# EAGLE design tes1 (EAGLE 6.2)
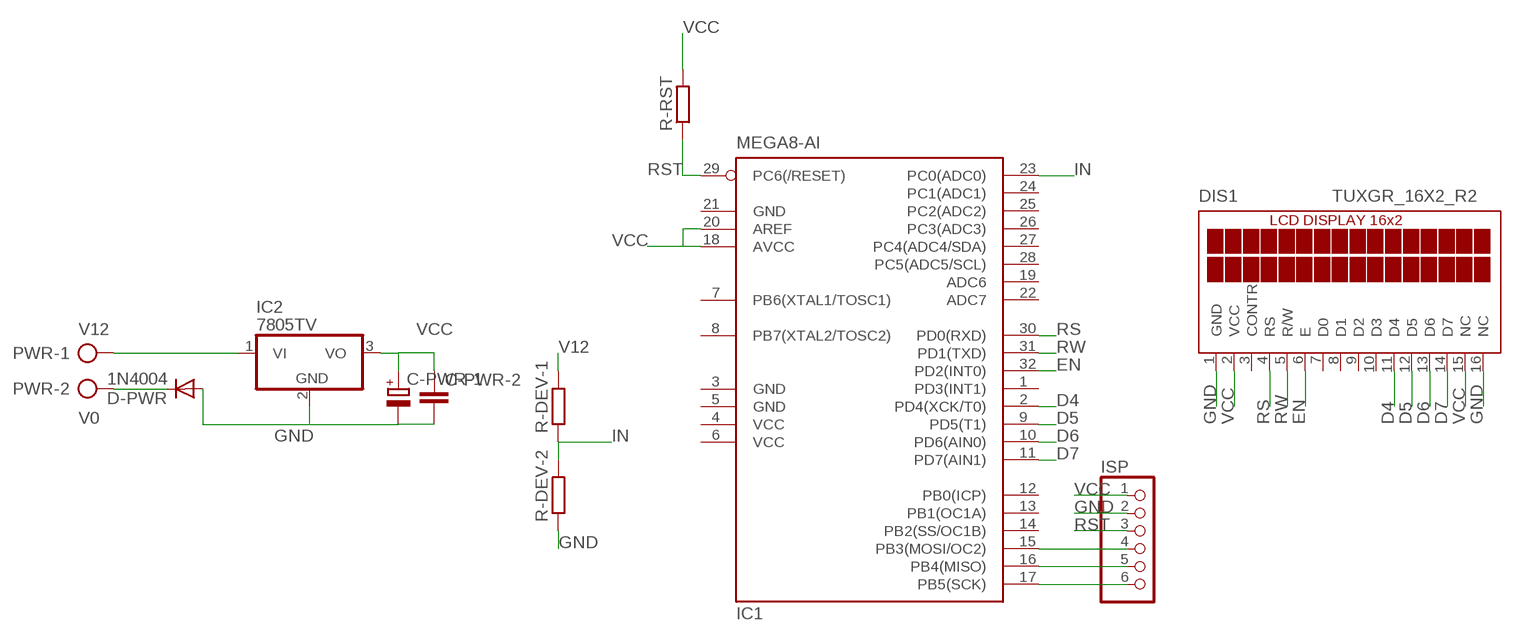
[diagram p0: schematic, sheet 1]

## Parts
C-PWR-1  CPOL-EUE2-5  [E2-5]
C-PWR-2  C-EU050-024X044  [C050-024X044]
D-PWR  1N4004  [DO41-10]
DIS1  TUXGR_16X2_R2  [TUXGR_16X2_R2]
IC1  MEGA8-AI  [TQFP32-08]
IC2  7805TV  [TO220V]
ISP  PINHD-1X6  [1X06]
PWR  AK300/2  [AK300/2]
R-DEV-1  R-EU_0204/7  [0204/7]
R-DEV-2  R-EU_0204/7  [0204/7]
R-RST  R-EU_0204/7  [0204/7]

## Nets
D4: DIS1.11(D4) IC1.2(PD4(XCK/T0))
D5: DIS1.12(D5) IC1.9(PD5(T1))
D6: DIS1.13(D6) IC1.10(PD6(AIN0))
D7: DIS1.14(D7) IC1.11(PD7(AIN1))
EN: DIS1.6(E) IC1.32(PD2(INT0))
GND: C-PWR-1.- C-PWR-2.2 D-PWR.A DIS1.1(GND) DIS1.16(NC) IC2.2(GND) ISP.2 R-DEV-2.1
IN: IC1.23(PC0(ADC0)) R-DEV-1.1 R-DEV-2.2
N$15: IC1.17(PB5(SCK)) ISP.6
N$16: IC1.16(PB4(MISO)) ISP.5
N$17: IC1.15(PB3(MOSI/OC2)) ISP.4
RS: DIS1.4(RS) IC1.30(PD0(RXD))
RST: IC1.29(PC6(/RESET)) ISP.3 R-RST.1
RW: DIS1.5(R/W) IC1.31(PD1(TXD))
V0: D-PWR.C PWR.2
V12: IC2.1(VI) PWR.1 R-DEV-1.2
VCC: C-PWR-1.+ C-PWR-2.1 DIS1.2(VCC) DIS1.15(NC) IC1.18(AVCC) IC1.20(AREF) IC2.3(VO) ISP.1 R-RST.2
Unconnected: DIS1.3(CONTR) DIS1.7(D0) DIS1.8(D1) DIS1.9(D2) DIS1.10(D3) IC1.1(PD3(INT1)) IC1.7(PB6(XTAL1/TOSC1)) IC1.8(PB7(XTAL2/TOSC2)) IC1.12(PB0(ICP)) IC1.13(PB1(OC1A)) IC1.14(PB2(SS/OC1B)) IC1.19(ADC6) IC1.22(ADC7) IC1.24(PC1(ADC1)) IC1.25(PC2(ADC2)) IC1.26(PC3(ADC3)) IC1.27(PC4(ADC4/SDA)) IC1.28(PC5(ADC5/SCL))

## Power pins joined to a net without a drawn wire
GND: IC1.3(GND) IC1.5(GND) IC1.21(GND)
VCC: IC1.4(VCC) IC1.6(VCC)

## Library data of the parts
C-PWR-1 = resistor:CPOL-EU: POLARIZED CAPACITOR, European symbol
C-PWR-2 = resistor:C-EU: CAPACITOR, European symbol
D-PWR = diode:1N4004: DIODE general purpose rectifier, 1 A
DIS1 = display-lcd:TUXGR_16X2_R2: Tuxgraphics LCD display 16x2 characters reflective, without background light Source: tuxgr_12x2_r2.pdf; OC_FARNELL: unknown; OC_NEWARK: unknown
IC1 = atmel:MEGA8: MICROCONTROLLER 8 Kbytes FLASH, 1 kbytes SRAM, 512 bytes EEPROM, USART, 6-channel 10 bit ADC, 2-channel 8 bit ADC Pin compatible with Atmega48, ATMega88, ATMega168 Source: avr.lbr; MPN: ATMEGA8-16AU; OC_FARNELL: 9171371; OC_NEWARK: 73M8863
IC2 = linear:78*: Positive VOLTAGE REGULATOR Source: http://cache.national.com/ds/LM/LM78L05.pdf http://www.fairchildsemi.com/ds/LM/LM7805.pdf
ISP = pinhead:PINHD-1X6: PIN HEADER
PWR = con-ptr500:AK300/2: CONNECTOR; OC_FARNELL: unknown; OC_NEWARK: unknown
R-DEV-1 R-DEV-2 R-RST = resistor:R-EU_: RESISTOR, European symbol

## Board
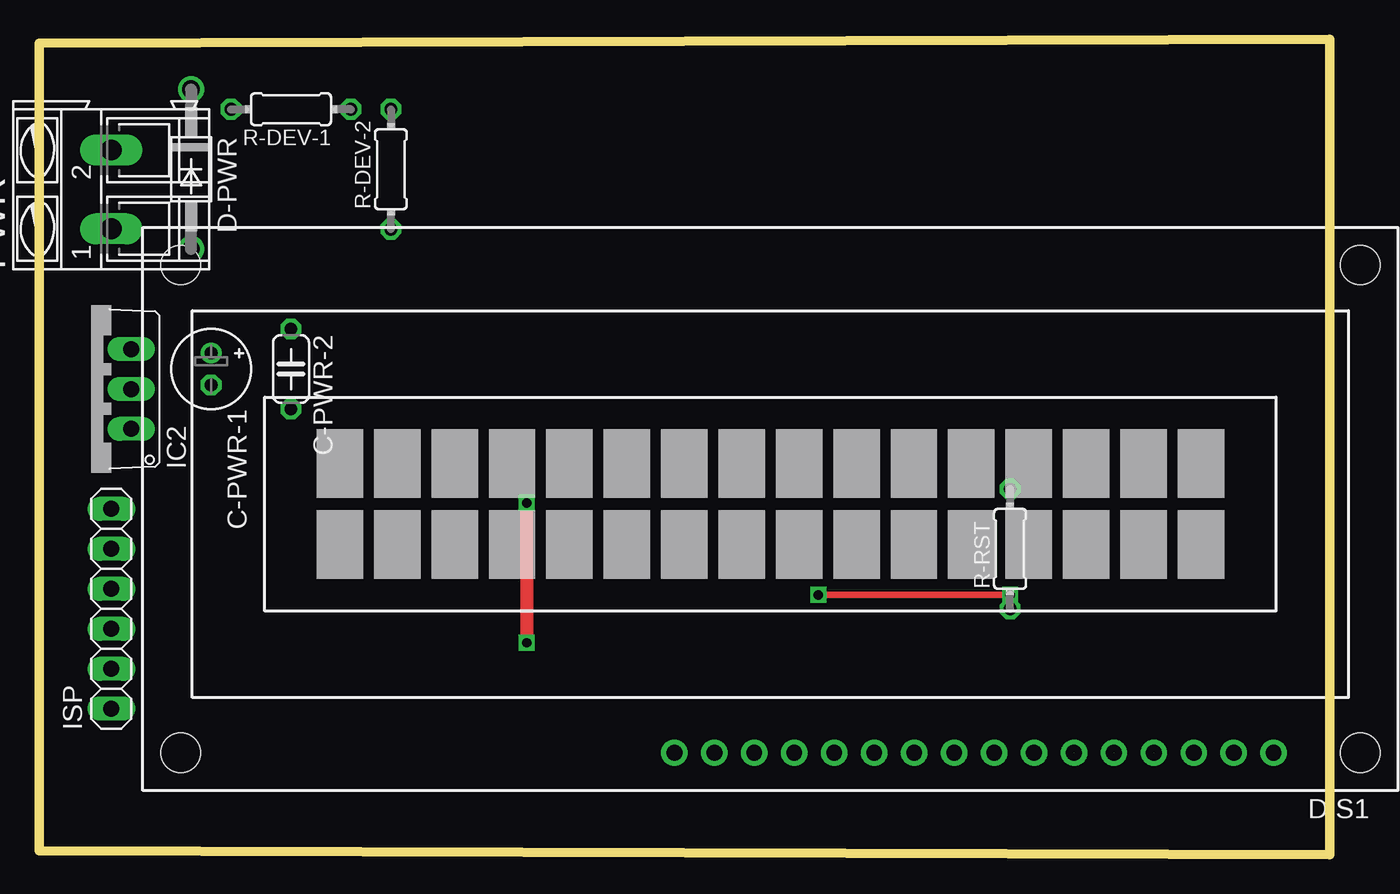
[diagram p1: board, top side]
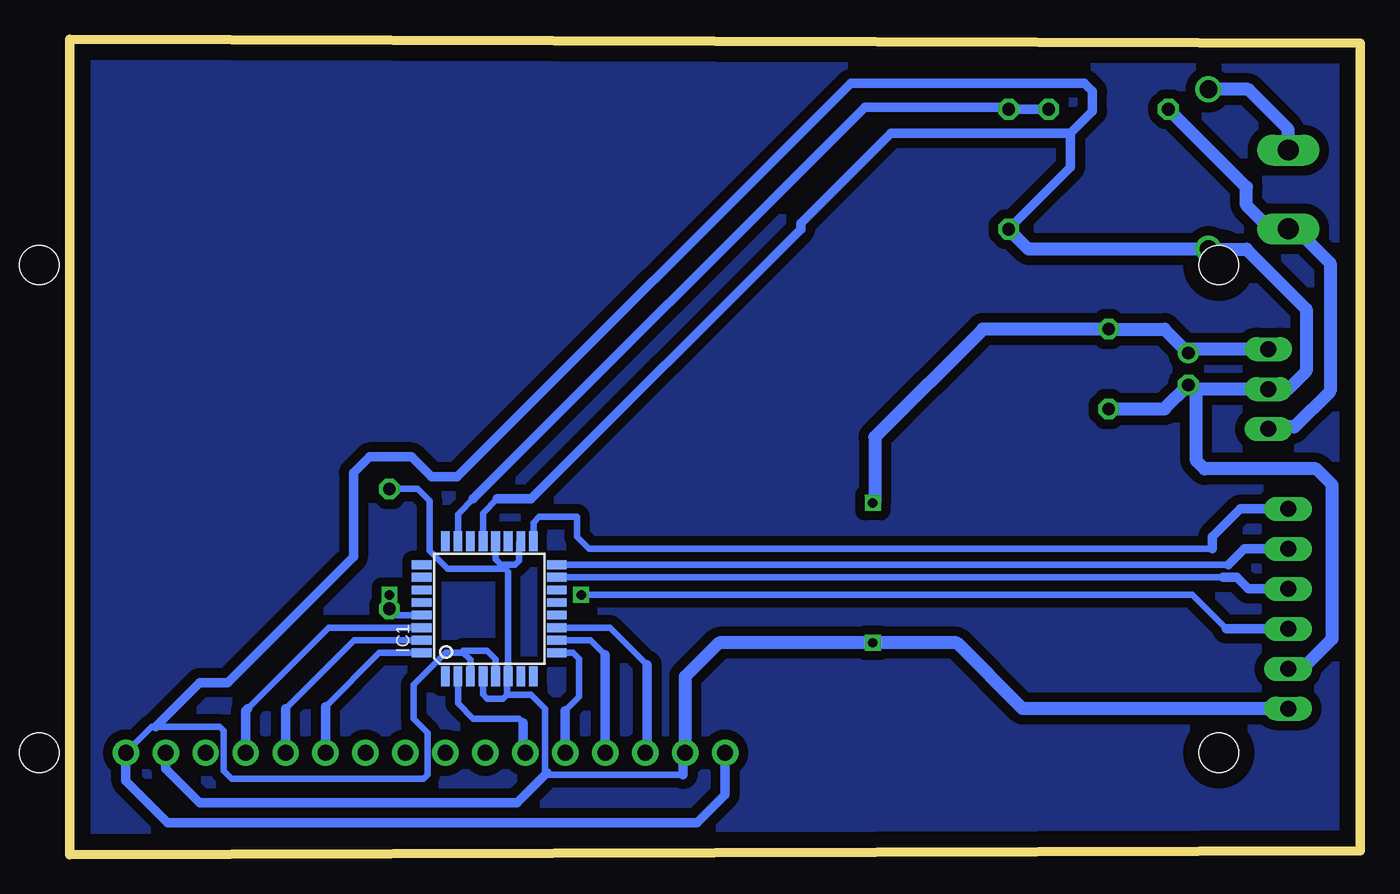
[diagram p2: board, bottom side, seen from below]

Size 82.04 x 51.82 mm. Coordinates in mm from the lower left corner, seen from the top.
Outline: 0,51.56 82.04,51.82 82.04,0 0,0.25 0,51.56
Copper layers (1*16): Top 0.035mm / dielectric 1.5mm / Bottom 0.035mm
Design rules: minimum track width 10mil, minimum drill 24mil, track to track 8mil, track to pad 8mil, pad to pad 8mil, via to via 8mil, smd to smd 8mil, copper to edge 40mil, drill to drill 8mil, minimum pad ring 10mil, minimum via ring 8mil, stop-mask expansion 4mil, vias tented up to drill 0mil, thermal gap 10mil

### Footprints (pad centres in the part's own frame; a part is rotated, then mirrored left to right if it is on the bottom)
E2-5 = drill 0.813 pad 1.27: + -1.016,0 | drill 0.813 pad 1.27 octagon: - 1.016,0
C050-024X044 = drill 0.813 octagon: 1 -2.54,0; 2 2.54,0
DO41-10 = drill 1.118: A 5.08,0; C -5.08,0
TUXGR_16X2_R2 = drill 1 pad 1.676: 1 -32,15.5; 2 -29.46,15.5; 3 -26.92,15.5; 4 -24.38,15.5; 5 -21.84,15.5; 6 -19.3,15.5; 7 -16.76,15.5; 8 -14.22,15.5; 9 -11.68,15.5; 10 -9.14,15.5; 11 -6.6,15.5; 12 -4.06,15.5; 13 -1.52,15.5; 14 1.02,15.5; 15 3.56,15.5; 16 6.1,15.5 | hole 2.5: -37.5,-15.5; 37.5,-15.5; -37.5,15.5; 37.5,15.5
TQFP32-08 = smd 1.27 x 0.559: 1 -4.293,2.8; 2 -4.293,2; 3 -4.293,1.2; 4 -4.293,0.4; 5 -4.293,-0.4; 6 -4.293,-1.2; 7 -4.293,-2; 8 -4.293,-2.8; 17 4.293,-2.8; 18 4.293,-2; 19 4.293,-1.2; 20 4.293,-0.4; 21 4.293,0.4; 22 4.293,1.2; 23 4.293,2; 24 4.293,2.8 | smd 0.559 x 1.27: 9 -2.8,-4.293; 10 -2,-4.293; 11 -1.2,-4.293; 12 -0.4,-4.293; 13 0.4,-4.293; 14 1.2,-4.293; 15 2,-4.293; 16 2.8,-4.293; 25 2.8,4.293; 26 2,4.293; 27 1.2,4.293; 28 0.4,4.293; 29 -0.4,4.293; 30 -1.2,4.293; 31 -2,4.293; 32 -2.8,4.293
TO220V = drill 1.016 long: 1 -2.54,-2.54; 2 0,-2.54; 3 2.54,-2.54
1X06 = drill 1.016 long: 1 -6.35,0; 2 -3.81,0; 3 -1.27,0; 4 1.27,0; 5 3.81,0; 6 6.35,0
AK300/2 = drill 1.321 long: 1 -2.515,0; 2 2.489,0
0204/7 = drill 0.813 octagon: 1 -3.81,0; 2 3.81,0

### Placement (x,y rotation side)
C-PWR-1  10.92,30.86 270 top
C-PWR-2  16,30.86 270 top
D-PWR  9.65,43.56 270 top
DIS1  46.48,21.97 180 top
IC1  55.37,15.62 90 bottom
IC2  3.3,29.59 90 top
ISP  4.57,15.62 90 top
PWR  4.57,42.29 90 top
R-DEV-1  16,47.37 180 top
R-DEV-2  22.35,43.56 90 top
R-RST  61.72,19.43 90 top

### Tracks (layer width: path | path; a pad name or v marks a point on that pad's centre or on a via)
D4
  Bottom 0.406: IC1.2 57.37,9.62 56.39,8.64 53.47,8.64 53.21,8.38
  Bottom 0.61: 53.21,8.38 53.21,6.6 DIS1.11
D5
  Bottom 0.406: IC1.9 50.03,12.82 49.66,12.45 49.66,10.03 50.55,9.14
  Bottom 0.61: 50.55,9.14 DIS1.12
D6
  Bottom 0.406: IC1.10 48.93,13.62 48.01,12.7
  Bottom 0.61: 48.01,12.7 DIS1.13
D7
  Bottom 0.406: IC1.11 47.7,14.42 45.34,12.07
  Bottom 0.61: 45.34,12.07 45.34,6.59 DIS1.14
EN  (1 unrouted)
  Bottom 0.406: IC1.32 62.36,12.82 65.79,9.4
  Bottom 0.61: DIS1.6 65.79,9.4
GND
  Bottom 0.406: 78.36,4.57 78.49,4.7 | IC1.3 56.57,12.38 57.02,12.83 57.15,12.83 | 57.15,12.83 58.17,12.83 60.2,10.79 60.2,8.64 59.31,7.75 59.31,5.08 59.56,4.83 71.75,4.83 72.26,5.33 72.26,7.87 72.52,8.13 76.58,8.13 76.83,8.13 DIS1.1 | IC1.5 54.97,12.43 55.5,12.95 57.02,12.95 57.15,12.83 | IC1.21 55.77,21.7 54.86,22.61
  Bottom 0.61: DIS1.1 78.49,4.7 75.82,2.03 42.16,2.03 40.38,3.81 DIS1.16 | 54.86,22.61 52.7,22.61 35.56,39.75 35.56,40.13 29.84,45.85 18.41,45.85 | 18.41,45.85 17.02,47.24 17.02,48.51 17.53,49.02 32.38,49.02 57.4,24 59.06,24 60.33,25.27 62.99,25.27 64.01,24.26 64.01,18.92 72.01,10.92 73.79,10.92 76.58,8.13 | 18.41,45.85 18.41,43.69 R-DEV-2.1
  Bottom 0.813: R-DEV-2.1 21.08,38.48 D-PWR.A 7.24,38.48 3.43,34.67 3.43,30.73 4.57,29.59 IC2.2 10.67,29.59 C-PWR-1.- | C-PWR-2.2 12.45,28.32 C-PWR-1.- | ISP.2 3.68,11.81 1.78,13.72 1.78,23.5 2.79,24.51 9.91,24.51 10.41,25.02 10.41,29.34 C-PWR-1.-
IN
  Bottom 0.406: IC1.23 57.37,21.62 56.39,22.61
  Bottom 0.61: 56.39,22.61 31.5,47.5 22.48,47.5 R-DEV-2.2 R-DEV-1.1
N$1
  pour Bottom (isolate 0.61): 0.25,51.44 82.17,51.44 82.17,0 0.25,0 0.25,51.31
N$15
  Bottom 0.406: IC1.17 52.57,21.09 52.2,21.46 49.78,21.46 49.78,20.19 49.02,19.43 9.4,19.43
  Bottom 0.61: 9.4,19.43 9.4,20.19 7.62,21.97 ISP.6
N$16
  Bottom 0.406: IC1.16 8.38,18.42
  Bottom 0.61: 8.38,18.42 7.37,19.43 ISP.5
N$17
  Bottom 0.406: IC1.15 8.73,17.62
  Bottom 0.61: 8.73,17.62 7.84,17.62 7.11,16.89 ISP.4
RS  (1 unrouted)
  Bottom 0.406: IC1.30 65.59,14.42 70.74,9.27
  Bottom 0.61: DIS1.4 70.87,9.14 70.74,9.27
RST  (via drill 0.6)
  Top 0.406: v61.72,16.51 v49.53,16.51
  Bottom 0.406: IC1.29 61.32,15.22 R-RST.1 v61.72,16.51 | v49.53,16.51 10.67,16.51 8.51,14.35
  Bottom 0.61: 8.51,14.35 ISP.3
RW  (1 unrouted)
  Bottom 0.406: IC1.31 63.98,13.62 68.33,9.27
  Bottom 0.61: DIS1.5 68.33,9.27
V0
  Bottom 0.813: PWR.2 4.57,46.1 7.11,48.64 D-PWR.C
V12
  Bottom 0.813: R-DEV-1.2 7.24,42.42 7.24,41.28 5.74,39.78 PWR.1 4.09,39.78 1.91,37.59 1.91,29.46 4.19,27.18 5.72,27.18 IC2.1
VCC  (via drill 0.6)
  Top 0.813: v30.99,22.35 v30.99,13.46
  Bottom 0.406: 54.61,18.41 53.72,18.41 53.47,18.67 53.47,19.82 IC1.18 | 54.36,18.16 54.17,17.98 IC1.6 54.23,11.27 54.23,10.16 | 54.36,18.16 54.61,18.41 | IC1.4 55.77,10.18 55.5,9.91 54.48,9.91 54.23,10.16 | IC1.20 54.97,18.78 54.61,18.41 | 54.36,18.16 58.04,18.16 59.18,19.3 59.18,22.48 59.94,23.24 R-RST.2 | 54.23,10.16 52.7,10.16 51.82,9.27 51.82,5.33 51.69,5.21 51.56,5.08 43.05,5.08
  Bottom 0.61: 43.05,5.08 43.05,6.34 DIS1.15 | DIS1.2 75.94,5.46 73.79,3.3 53.59,3.3 51.69,5.21
  Bottom 0.813: IC2.3 10.67,32.13 C-PWR-1.+ 12.45,33.4 C-PWR-2.1 24,33.4 30.86,26.54 30.86,22.35 v30.99,22.35 | ISP.1 21.46,9.27 25.65,13.46 v30.99,13.46 40.77,13.46 42.93,11.3 DIS1.15